# EAGLE schematic dooraccessystem (EAGLE 6.2)
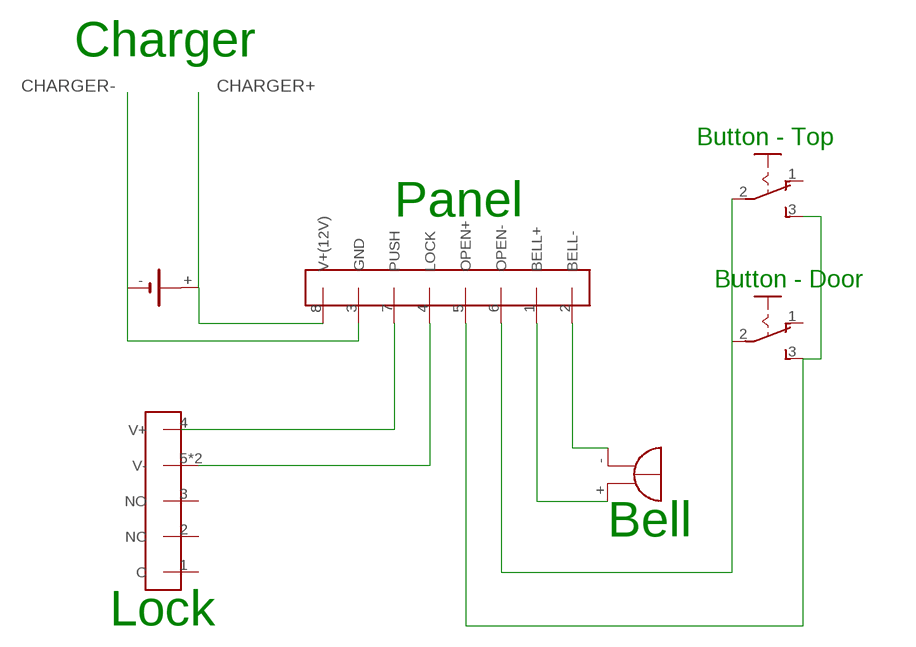
[diagram p0: schematic, sheet 1]

## Parts
BATTERY  CRAA  [CRAA]
LOCK  MAGNETLOCK  [DIL06]
PANEL  DOORACCESSFRONTPANEL  [DIL08]
S1  255SB  [255SB]
S2  255SB  [255SB]
SPEAKER  EB2209A  [EB2209A]

## Nets
CHARGER+: BATTERY.+ PANEL.8(V+(12V))
CHARGER-: BATTERY.- PANEL.3(GND)
N$1: PANEL.7(PUSH)
N$2: LOCK.5(V-) LOCK.6(V-) PANEL.4(LOCK)
N$3: PANEL.1(BELL+) SPEAKER.+
N$4: PANEL.2(BELL-) SPEAKER.-
N$5: PANEL.6(OPEN-) S1.2(P) S2.2(P)
N$6: PANEL.5(OPEN+) S1.3(S) S2.3(S)
Unconnected: BATTERY.+@1(+) LOCK.1(C) LOCK.2(NC) LOCK.3(NO) S1.1(O) S2.1(O)

## Notes on the sheet
- Charger
- Button - Top
- Panel
- Button - Door
- Bell
- Lock

## Power pins joined to a net without a drawn wire
V+: LOCK.4(V+)

## Library data of the parts
BATTERY = battery:CRAA: LI BATTERY Varta
LOCK = hsg-door:MAGNETLOCK
PANEL = hsg-door:DOORACCESSFRONTPANEL: Connector to the Front Panel of the Door Access System
S1 S2 = switch:255SB: SLIDING SWITCH Distributor Buerklin, 11G810
SPEAKER = buzzer:EB2209A: BUZZER Source: Buerklin; OC_FARNELL: unknown; OC_NEWARK: unknown